# EAGLE design natb_square_chip (EAGLE 9.6.2)
CHECKED_BY: -; DRAWN_BY: NATB; REV: 1.0; TITLE: Square Chip
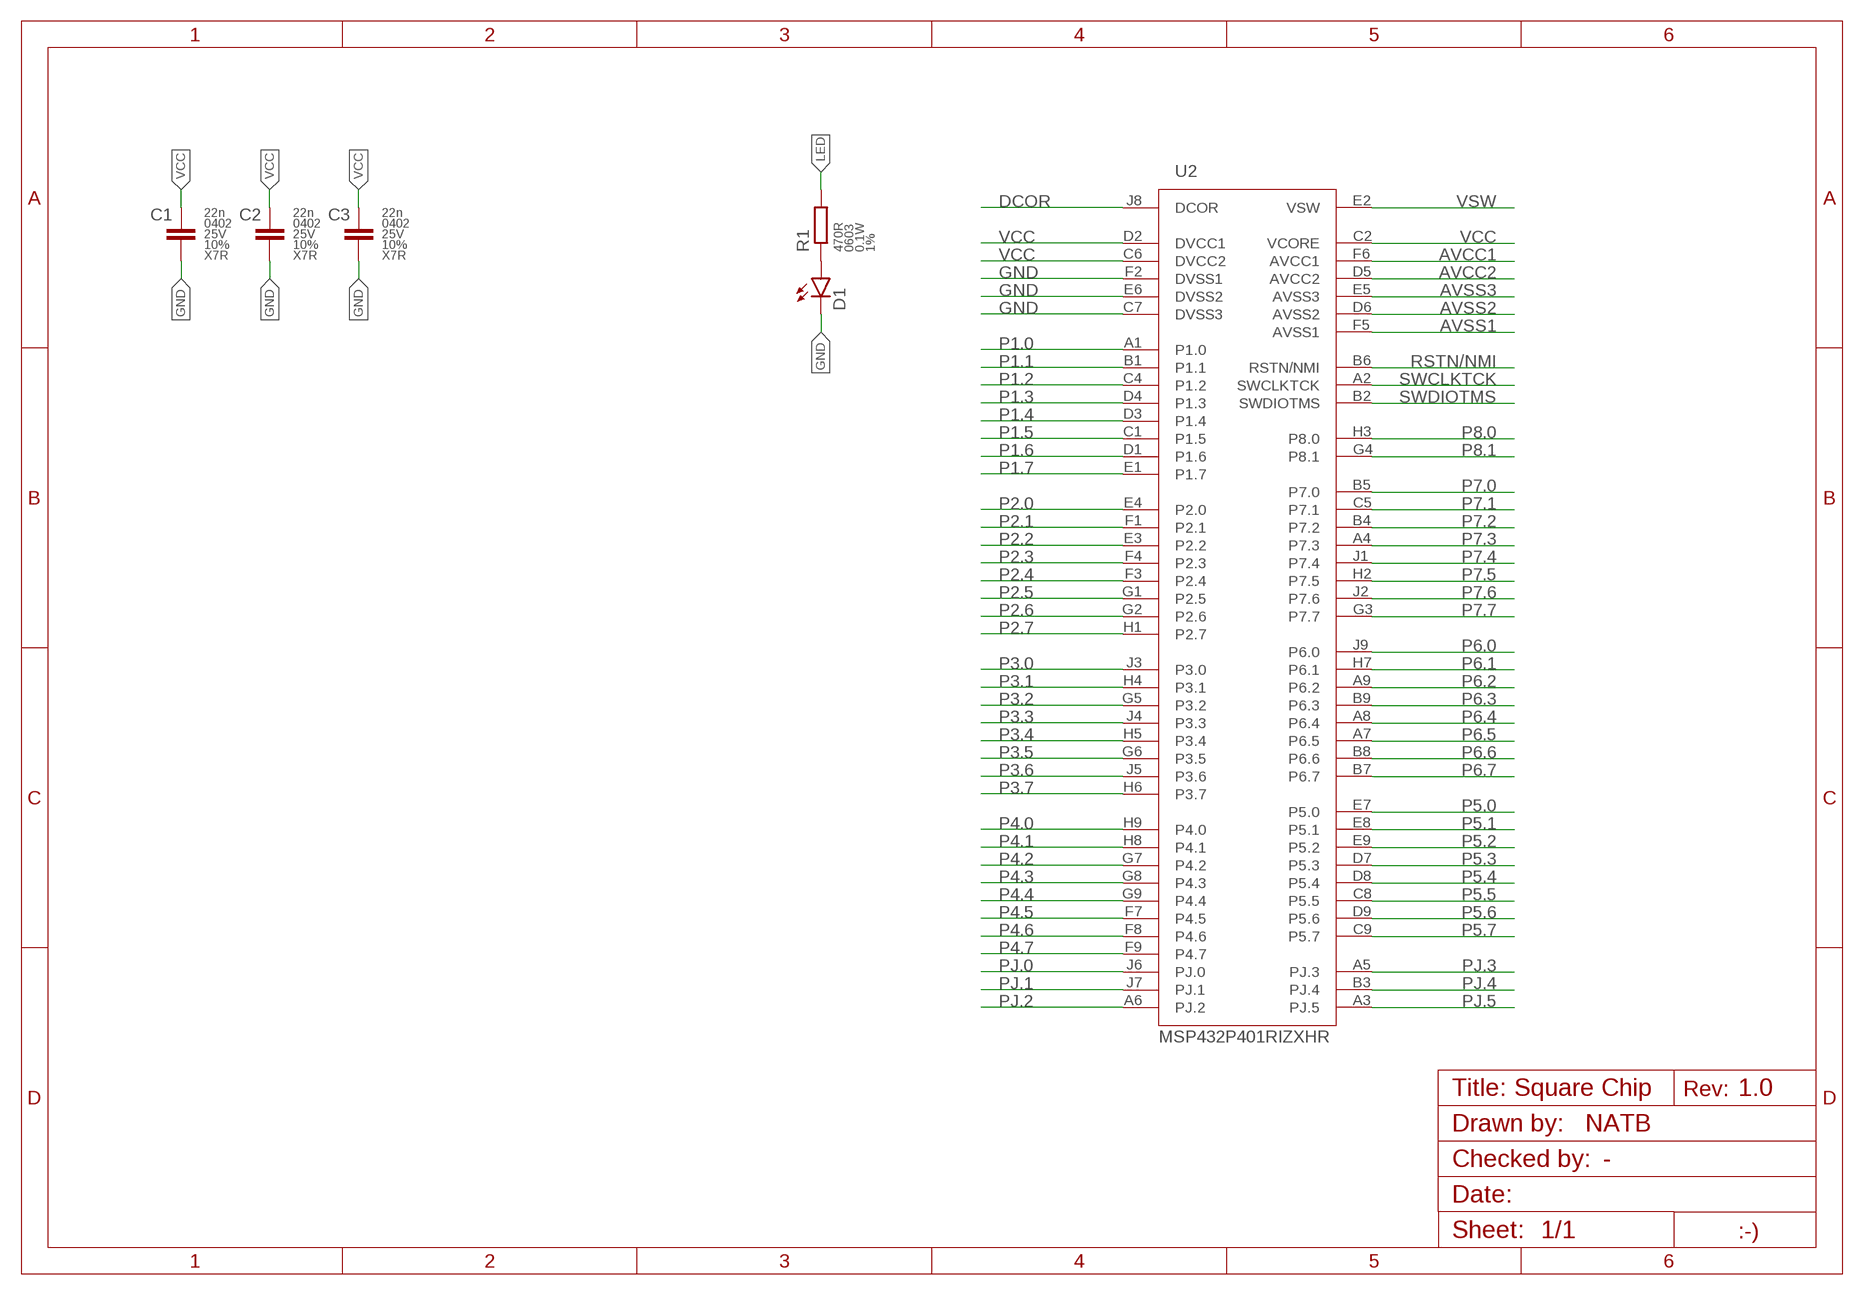
[diagram p0: schematic, sheet 1]

## Parts
C1  22n  22NF-0402-25V-10%  [C0402]
C2  22n  22NF-0402-25V-10%  [C0402]
C3  22n  22NF-0402-25V-10%  [C0402]
D1  LEDCHIP-LED0603  [CHIP-LED0603]
R1  470R  470OHM-0603-1/10W-1%  [R0603]
U2  MSP432P401RIZXHR  [BGA80]

## Nets
AVCC1: U2.F6(AVCC1)
AVCC2: U2.D5(AVCC2)
AVSS1: U2.F5(AVSS1)
AVSS2: U2.D6(AVSS2)
AVSS3: U2.E5(AVSS3)
DCOR: U2.J8(DCOR)
GND: C1.2 C2.2 C3.2 D1.C U2.C7(DVSS3) U2.E6(DVSS2) U2.F2(DVSS1)
LED: R1.2
N$1: D1.A R1.1
P1.0: U2.A1(P1.0)
P1.1: U2.B1(P1.1)
P1.2: U2.C4(P1.2)
P1.3: U2.D4(P1.3)
P1.4: U2.D3(P1.4)
P1.5: U2.C1(P1.5)
P1.6: U2.D1(P1.6)
P1.7: U2.E1(P1.7)
P2.0: U2.E4(P2.0)
P2.1: U2.F1(P2.1)
P2.2: U2.E3(P2.2)
P2.3: U2.F4(P2.3)
P2.4: U2.F3(P2.4)
P2.5: U2.G1(P2.5)
P2.6: U2.G2(P2.6)
P2.7: U2.H1(P2.7)
P3.0: U2.J3(P3.0)
P3.1: U2.H4(P3.1)
P3.2: U2.G5(P3.2)
P3.3: U2.J4(P3.3)
P3.4: U2.H5(P3.4)
P3.5: U2.G6(P3.5)
P3.6: U2.J5(P3.6)
P3.7: U2.H6(P3.7)
P4.0: U2.H9(P4.0)
P4.1: U2.H8(P4.1)
P4.2: U2.G7(P4.2)
P4.3: U2.G8(P4.3)
P4.4: U2.G9(P4.4)
P4.5: U2.F7(P4.5)
P4.6: U2.F8(P4.6)
P4.7: U2.F9(P4.7)
P5.0: U2.E7(P5.0)
P5.1: U2.E8(P5.1)
P5.2: U2.E9(P5.2)
P5.3: U2.D7(P5.3)
P5.4: U2.D8(P5.4)
P5.5: U2.C8(P5.5)
P5.6: U2.D9(P5.6)
P5.7: U2.C9(P5.7)
P6.0: U2.J9(P6.0)
P6.1: U2.H7(P6.1)
P6.2: U2.A9(P6.2)
P6.3: U2.B9(P6.3)
P6.4: U2.A8(P6.4)
P6.5: U2.A7(P6.5)
P6.6: U2.B8(P6.6)
P6.7: U2.B7(P6.7)
P7.0: U2.B5(P7.0)
P7.1: U2.C5(P7.1)
P7.2: U2.B4(P7.2)
P7.3: U2.A4(P7.3)
P7.4: U2.J1(P7.4)
P7.5: U2.H2(P7.5)
P7.6: U2.J2(P7.6)
P7.7: U2.G3(P7.7)
P8.0: U2.H3(P8.0)
P8.1: U2.G4(P8.1)
PJ.0: U2.J6(PJ.0)
PJ.1: U2.J7(PJ.1)
PJ.2: U2.A6(PJ.2)
PJ.3: U2.A5(PJ.3)
PJ.4: U2.B3(PJ.4)
PJ.5: U2.A3(PJ.5)
RSTN/NMI: U2.B6(RSTN/NMI)
SWCLKTCK: U2.A2(SWCLKTCK)
SWDIOTMS: U2.B2(SWDIOTMS)
VCC: C1.1 C2.1 C3.1 U2.C2(VCORE) U2.C6(DVCC2) U2.D2(DVCC1)
VSW: U2.E2(VSW)

## Library data of the parts
C1-C3 = zaan-Capacitors:22NF: 22nF capacitor; DESCRIPTION: Chip Capacitor; DIELECTRIC: X7R; MF: Wurth Electronics; MPN: 885012205052; PACKAGE: 1005; PACKAGE-IN: 0402; TOLERANCE: 10%; VOLTAGE: 25V
D1 = led:LED: LED OSRAM: - CHIPLED LG R971, LG N971, LY N971, LG Q971, LY Q971, LO R971, LY R971 LH N974, LH R974 LS Q976, LO Q976, LY Q976 LO Q996 - Hyper CHIPLED LW Q18S LB Q993, LB Q99A, LB R99A - SideLED LS A670, LO A670, LY A670, LG A670, LP A670 LB A673, LV A673, LT A673, LW A673 LH A674 LY A675 LS A676, LA A676, LO A676, LY A676, LW A676 LS A679, LY A679, LG A679 - Hyper Micro SIDELED® LS Y876, LA Y876, LO Y876, LY Y876 LT Y87S - SmartLED LW L88C, LW L88S LB L89C, LB L89S, LG L890 LS L89K, LO L89K, LY L89K LS L896, LA L896, LO L896, LY L896 - TOPLED LS T670, LO T670, LY T670, LG T670, LP T670 LSG T670, LSP T670, LSY T670, LOP T670, LYG T670 LG T671, LOG T671, LSG T671 LB T673, LV T673, LT T673, LW T673 LH T674 LS T676, LA T676, LO T676, LY T676, LB T676, LH T676, LSB T676, LW T676 LB T67C, LV T67C, LT T67C, LS T67K, LO T67K, LY T67K, LW E67C LS E67B, LA E67B, LO E67B, LY E67B, LB E67C, LV E67C, LT E67C LW T67C LS T679, LY T679, LG T679 LS T770, LO T770, LY T770, LG T770, LP T770 LB T773, LV T773, LT T773, LW T773 LH T774 LS E675, LA E675, LY E675, LS T675 LS T776, LA T776, LO T776, LY T776, LB T776 LHGB T686 LT T68C, LB T68C - Hyper Mini TOPLED® LB M676 - Mini TOPLED Santana® LG M470 LS M47K, LO M47K, LY M47K Source: http://www.osram.convergy.de LUXEON: - LUMILED® LXK2-PW12-R00, LXK2-PW12-S00, LXK2-PW14-U00, LXK2-PW14-V00 LXK2-PM12-R00, LXK2-PM12-S00, LXK2-PM14-U00 LXK2-PE12-Q00, LXK2-PE12-R00, LXK2-PE12-S00, LXK2-PE14-T00, LXK2-PE14-U00 LXK2-PB12-K00, LXK2-PB12-L00, LXK2-PB12-M00, LXK2-PB14-N00, LXK2-PB14-P00, LXK2-PB14-Q00 LXK2-PR12-L00, LXK2-PR12-M00, LXK2-PR14-Q00, LXK2-PR14-R00 LXK2-PD12-Q00, LXK2-PD12-R00, LXK2-PD12-S00 LXK2-PH12-R00, LXK2-PH12-S00 LXK2-PL12-P00, LXK2-PL12-Q00, LXK2-PL12-R00 Source: www.luxeon.com KINGBRIGHT: KA-3528ASYC Source: www.kingbright.com
R1 = zaan-Resistors:470OHM: 470Ω resistor; DESCRIPTION: Chip Resistor; MF: Yageo; MPN: RC0603FR-07470RL; PACKAGE: 1608; PACKAGE-IN: 0603; POWER: 0.1W; TOLERANCE: 1%; VOLTAGE: 75V
U2 = Microcontroller:MSP432P401RIZXHR: IC MCU 32BIT 256KB FLASH 80NFBGA Manufacturer's datasheet <http://www.ti.com/lit/ds/symlink/msp432p401r.pdf>; CREATED_BY: PCBLayout.com; DIGIKEY_PARTNO: 296-45566-6-ND; MANUFACTURER: Texas Instruments; MPN: MSP432P401RIZXHR; PACKAGE: 80-NFBGA

## Board
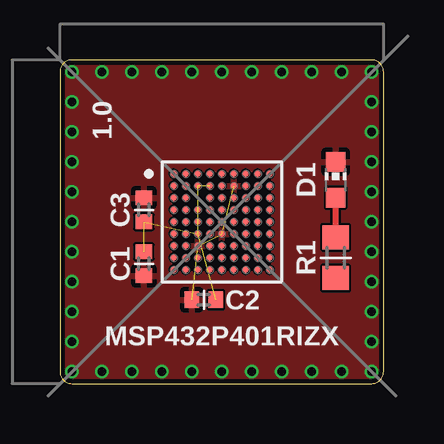
[diagram p1: board, top side]
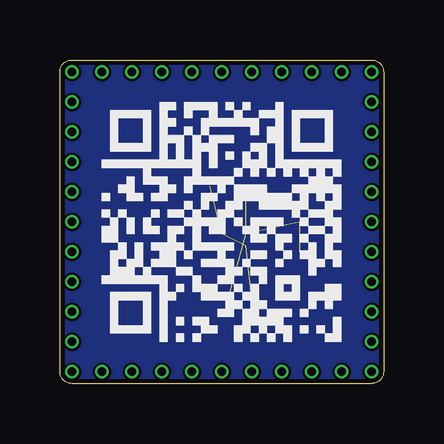
[diagram p2: board, bottom side, seen from below]

Size 13.5 x 13.5 mm. Coordinates in mm from the lower left corner, seen from the top.
Outline: 13,13.5 0.5,13.5 arc90 0,13 0,0.5 arc90 0.5,0 13,0 arc90 13.5,0.5 13.5,13 arc90 13,13.5
Copper layers (1+16): Top 0.035mm / dielectric 0.73mm / Bottom 0.035mm
Design rules "Multi-CB_4L_EET *": minimum track width 0.1mm, minimum drill 0.2mm, track to track 0.1mm, track to pad 0.1mm, pad to pad 0.1mm, via to via 0.1mm, smd to smd 0mil, copper to edge 0.2mm, drill to drill 0.2mm, minimum pad ring 0.125mm, minimum via ring 0.1mm, stop-mask expansion 2mil, vias tented up to drill 0.45mm, thermal gap 0.2mm

### Footprints (pad centres in the part's own frame; a part is rotated, then mirrored left to right if it is on the bottom)
C0402 = smd 0.6 x 0.7: 1 -0.5,0; 2 0.5,0
CHIP-LED0603 = smd 0.8 x 0.8: A 0,-0.75; C 0,0.75
R0603 = smd 1 x 1.1: 1 -0.85,0; 2 0.85,0
BGA80 = smd 0.25 x 0.25: A1 -2,2; A2 -2,1.5; A3 -2,1; A4 -2,0.5; A5 -2,0; A6 -2,-0.5; A7 -2,-1; A8 -2,-1.5; A9 -2,-2; B1 -1.5,2; B2 -1.5,1.5; B3 -1.5,1; B4 -1.5,0.5; B5 -1.5,0; B6 -1.5,-0.5; B7 -1.5,-1; B8 -1.5,-1.5; B9 -1.5,-2; C1 -1,2; C2 -1,1.5; C4 -1,0.5; C5 -1,0; C6 -1,-0.5; C7 -1,-1; C8 -1,-1.5; C9 -1,-2; D1 -0.5,2; D2 -0.5,1.5; D3 -0.5,1; D4 -0.5,0.5; D5 -0.5,0; D6 -0.5,-0.5; D7 -0.5,-1; D8 -0.5,-1.5; D9 -0.5,-2; E1 0,2; E2 0,1.5; E3 0,1; E4 0,0.5; E5 0,0; E6 0,-0.5; E7 0,-1; E8 0,-1.5; E9 0,-2; F1 0.5,2; F2 0.5,1.5; F3 0.5,1; F4 0.5,0.5; F5 0.5,0; F6 0.5,-0.5; F7 0.5,-1; F8 0.5,-1.5; F9 0.5,-2; G1 1,2; G2 1,1.5; G3 1,1; G4 1,0.5; G5 1,0; G6 1,-0.5; G7 1,-1; G8 1,-1.5; G9 1,-2; H1 1.5,2; H2 1.5,1.5; H3 1.5,1; H4 1.5,0.5; H5 1.5,0; H6 1.5,-0.5; H7 1.5,-1; H8 1.5,-1.5; H9 1.5,-2; J1 2,2; J2 2,1.5; J3 2,1; J4 2,0.5; J5 2,0; J6 2,-0.5; J7 2,-1; J8 2,-1.5; J9 2,-2

### Placement (x,y rotation side)
C1  3.5,5 270 top
C2  6,3.5 180 top
C3  3.5,7.25 90 top
D1  11.5,8.5 0 top
R1  11.5,5.25 270 top
U2  6.75,6.75 0 top
U$1  [QR-NATB-10]  11.75,1.75 0 bottom

### Tracks (layer width: path | path; a pad name or v marks a point on that pad's centre or on a via)
GND  (via drill 0.35)  (3 unrouted)
  other vias: 0.5,13 13,13 6.75,13 1.75,13 5.5,13 4.25,13 3,13 0.5,0.5 13,0.5 0.5,8 0.5,11.75 0.5,10.5 0.5,9.25 0.5,6.75 0.5,1.75 0.5,5.5 0.5,4.25 0.5,3 6.75,0.5 1.75,0.5 5.5,0.5 4.25,0.5 3,0.5 8,0.5 11.75,0.5 10.5,0.5 9.25,0.5 13,6.75 13,1.75 13,5.5 13,4.25 13,3 13,8 13,11.75 13,10.5 13,9.25 8,13 11.75,13 10.5,13 9.25,13
  pour Top: 0,0 0,13.5 13.5,13.5 13.5,0
N$1
  Top 0.254: R1.1 D1.A
VCC  (5 unrouted)
  pour Bottom: 0,0 0,13.5 13.5,13.5 13.5,0

### Text on the board
tNames: 1.0 | MSP432P401RIZX
tStop: NATB